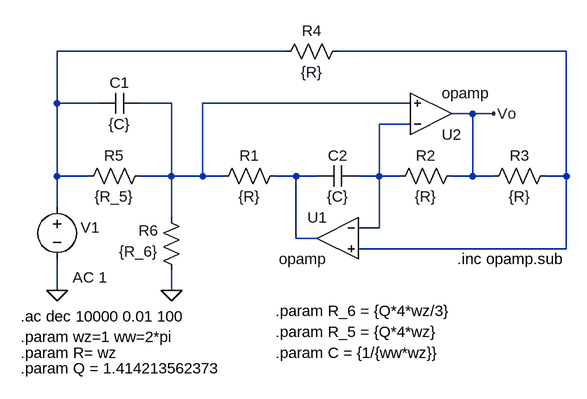
[diagram p0: schematic Ej2_b.asc]
Ej2_b.asc, the LTspice schematic file:
Version 4
SHEET 1 1584 1240
WIRE 240 -80 -112 -80
WIRE 672 -80 320 -80
WIRE -112 0 -112 -80
WIRE -48 0 -112 0
WIRE 64 0 16 0
WIRE 432 0 112 0
WIRE 528 16 496 16
WIRE 560 16 528 16
WIRE 432 32 384 32
WIRE -112 112 -112 0
WIRE -64 112 -112 112
WIRE 64 112 64 0
WIRE 64 112 16 112
WIRE 112 112 112 0
WIRE 112 112 64 112
WIRE 144 112 112 112
WIRE 256 112 224 112
WIRE 288 112 256 112
WIRE 384 112 384 32
WIRE 384 112 352 112
WIRE 416 112 384 112
WIRE 528 112 528 16
WIRE 528 112 496 112
WIRE 560 112 528 112
WIRE 672 112 672 -80
WIRE 672 112 640 112
WIRE -112 160 -112 112
WIRE 64 176 64 112
WIRE 384 192 384 112
WIRE 384 192 352 192
WIRE 256 208 256 112
WIRE 288 208 256 208
WIRE 672 224 672 112
WIRE 672 224 352 224
WIRE -112 288 -112 240
WIRE 64 288 64 256
FLAG 64 288 0
FLAG 560 16 Vo
FLAG -112 288 0
SYMBOL cap 16 -16 R90
WINDOW 0 0 32 VBottom 2
WINDOW 3 32 32 VTop 2
SYMATTR InstName C1
SYMATTR Value {C}
SYMBOL res 240 96 R90
WINDOW 0 0 56 VBottom 2
WINDOW 3 32 56 VTop 2
SYMATTR InstName R1
SYMATTR Value {R}
SYMBOL OpAmps\\opamp 320 144 M0
SYMATTR InstName U1
SYMBOL cap 352 96 R90
WINDOW 0 0 32 VBottom 2
WINDOW 3 32 32 VTop 2
SYMATTR InstName C2
SYMATTR Value {C}
SYMBOL res 656 96 R90
WINDOW 0 0 56 VBottom 2
WINDOW 3 32 56 VTop 2
SYMATTR InstName R3
SYMATTR Value {R}
SYMBOL res 512 96 R90
WINDOW 0 0 56 VBottom 2
WINDOW 3 32 56 VTop 2
SYMATTR InstName R2
SYMATTR Value {R}
SYMBOL res 336 -96 R90
WINDOW 0 0 56 VBottom 2
WINDOW 3 32 56 VTop 2
SYMATTR InstName R4
SYMATTR Value {R}
SYMBOL OpAmps\\opamp 464 80 M180
SYMATTR InstName U2
SYMBOL voltage -112 144 R0
WINDOW 123 24 124 Left 2
WINDOW 39 0 0 Left 0
WINDOW 0 36 47 Left 2
SYMATTR Value2 AC 1
SYMATTR InstName V1
SYMATTR Value ""
SYMBOL res 80 272 R180
WINDOW 0 36 76 Left 2
WINDOW 3 36 44 Left 2
SYMATTR InstName R6
SYMATTR Value {R_6}
SYMBOL res 32 96 R90
WINDOW 0 0 56 VBottom 2
WINDOW 3 32 56 VTop 2
SYMATTR InstName R5
SYMATTR Value {R_5}
TEXT -168 384 Left 2 !.param R= wz
TEXT 224 384 Left 2 !.param C = {1/{ww*wz}}
TEXT 224 352 Left 2 !.param R_5 = {Q*4*wz}
TEXT 504 240 Left 2 !.inc opamp.sub
TEXT -168 328 Left 2 !.ac dec 10000 0.01 100
TEXT -168 360 Left 2 !.param wz=1 ww=2*pi
TEXT 224 320 Left 2 !.param R_6 = {Q*4*wz/3}
TEXT -168 408 Left 2 !.param Q = 1.414213562373

The netlist it stands for:
* Ej2_b.asc
C1 N003 N001 {C}
R1 N005 N003 {R}
XU1 N004 N002 N005 opamp Aol=100K GBW=10Meg  ; pins invin noninvin out
C2 N004 N005 {C}
R3 N002 Vo {R}
R2 Vo N004 {R}
R4 N002 N001 {R}
XU2 N004 N003 Vo opamp Aol=100K GBW=10Meg  ; pins invin noninvin out
V1 N001 0 AC 1
R6 0 N003 {R_6}
R5 N003 N001 {R_5}
.param R= wz
.param C = {1/{ww*wz}}
.param R_5 = {Q*4*wz}
.inc opamp.sub
.ac dec 10000 0.01 100
.param wz=1 ww=2*pi
.param R_6 = {Q*4*wz/3}
.param Q = 1.414213562373
.backanno
.end